# Altium schematic sheet Fake_ACS_Board_Schematic.SchDoc
size A
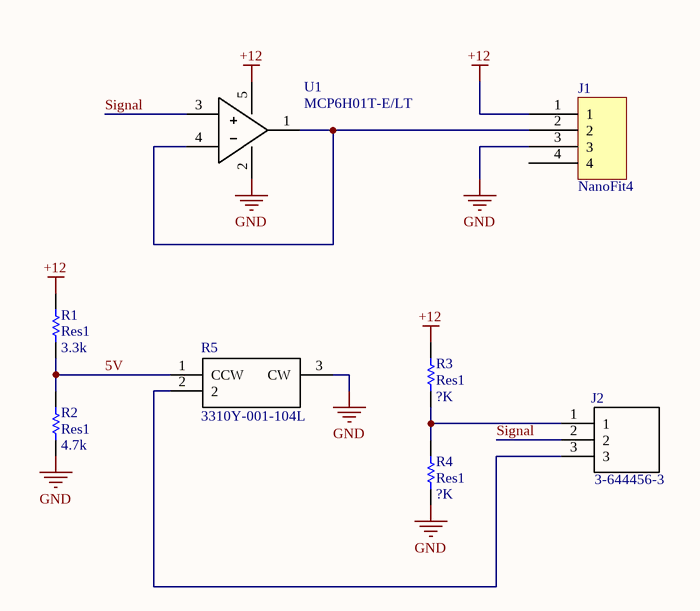
[diagram p0: Fake_ACS_Board_Schematic.SchDoc]

## Parts
J1  NanoFit4  [1053141304]
J2  3-644456-3  [*TE_3-644456-3]
R1  Res1  value 3.3k  [RESC1608X06N]
R2  Res1  value 4.7k  [RESC1608X06N]
R3  Res1  value ?K  [RESC1608X06N]
R4  Res1  value ?K  [RESC1608X06N]
R5  3310Y-001-104L  [3310Y-001]
U1  MCP6H01T-E/LT  [SOT95P270X115-5N]

## Nets
+12: J1.1 R1.2 R3.2 U1.5(VDD)
GND: J1.3 R2.1 R4.1 R5.3(CW) U1.2(VSS)
5V: R1.1 R2.2 R5.1(CCW)
Signal: J2.2 U1.3(IN1+)
NetJ1_2: J1.2 U1.1(VOUT) U1.4(IN1-)
NetJ2_1: J2.1 R3.1 R4.2
NetJ2_3: J2.3 R5.2

Not connected (* = marked no-connect by the designer): J1 4

## Library data of the parts
R1-R4 = Res1: Resistor; Published: 8-Jun-2000; LatestRevisionDate: 17-Jul-2002; LatestRevisionNote: Re-released for DXP Platform.; PackageReference: AXIAL-0.3; Publisher: Altium Limited; PackageDescription: Axial Device, Thru-Hole; 2 Leads; 0.3 in Pin Spacing
R5 = 3310Y-001-104L: Resistor; Manufacturer_Name: Bourns; Datasheet Link: http://www.bourns.com/docs/Product-Datasheets/3310.pdf; Manufacturer_Part_Number: 3310Y-001-104L; Mouser Part Number: 652-3310Y-001-104L; Mouser Price/Stock: https://www.mouser.com/Search/Refine.aspx?Keyword=652-3310Y-001-104L; RS Part Number: 2508317400; RS Price/Stock: http://uk.rs-online.com/web/p/products/2508317400
J2 = 3-644456-3: Value: *